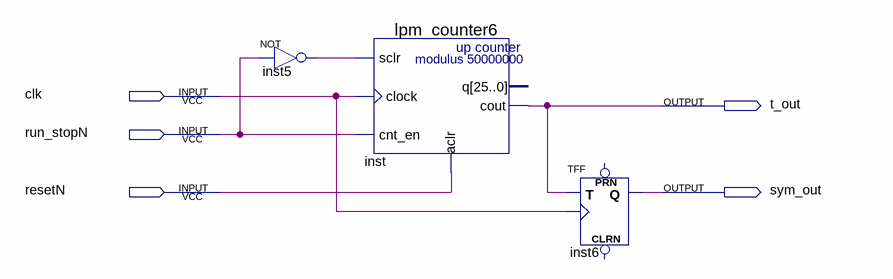
[diagram p0: schematic sheet]
// Quartus schematic centgen.bdf as structural Verilog: 3 symbols, 5 pins
module centgen (
  input  clk,
  input  run_stopN,
  input  resetN,
  output t_out,
  output sym_out
);

  wire inst5_out;

  not inst5 (inst5_out, run_stopN);
  lpm_counter6 inst (.sclr(inst5_out), .clock(clk), .cnt_en(run_stopN), .aclr(resetN), .cout(t_out));  // open: q
  TFF inst6 (.T(t_out), .CLK(clk), .Q(sym_out));  // open: PRN, CLRN
endmodule
